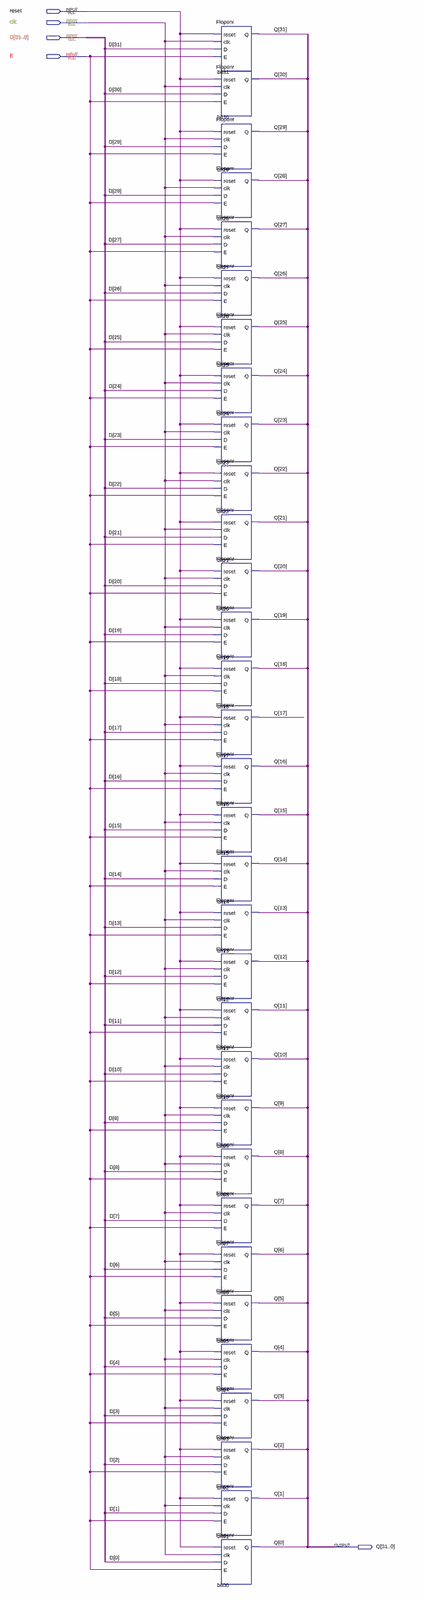
[diagram p0: schematic sheet, whole]
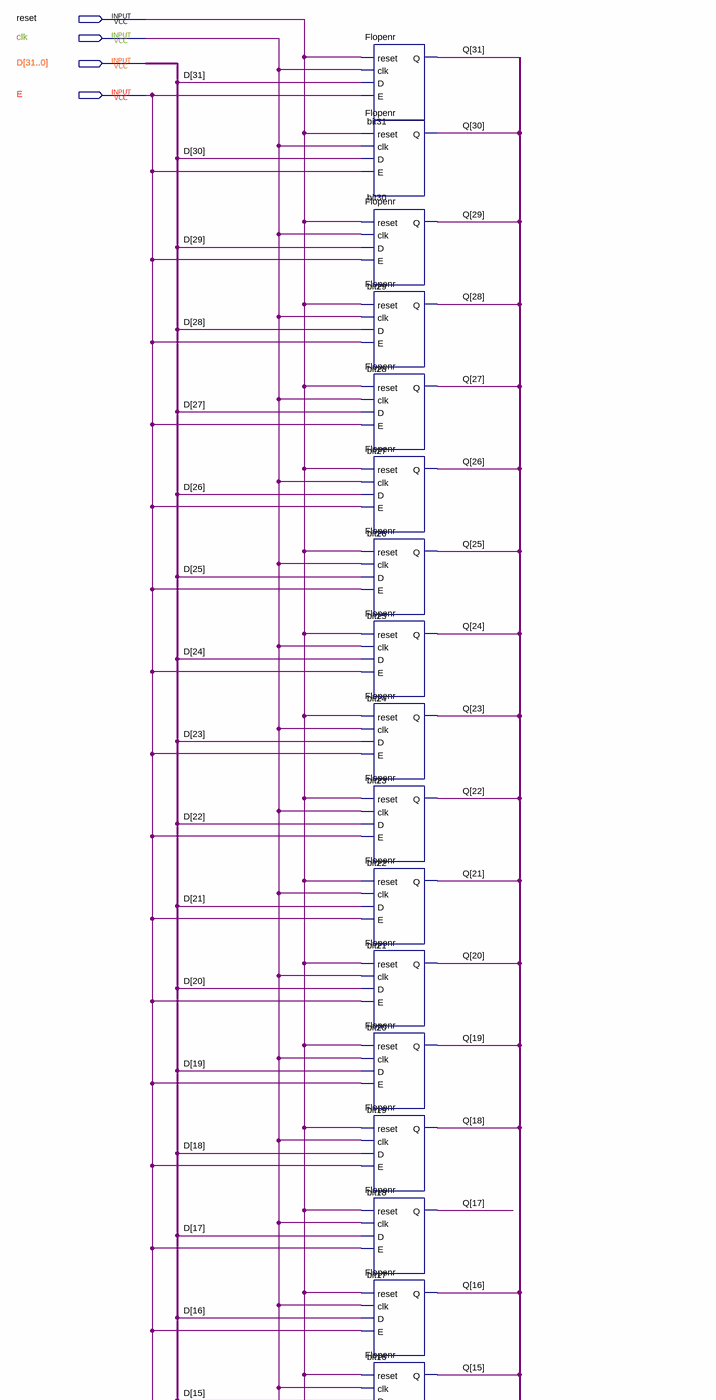
[diagram p1: schematic sheet, upper part]
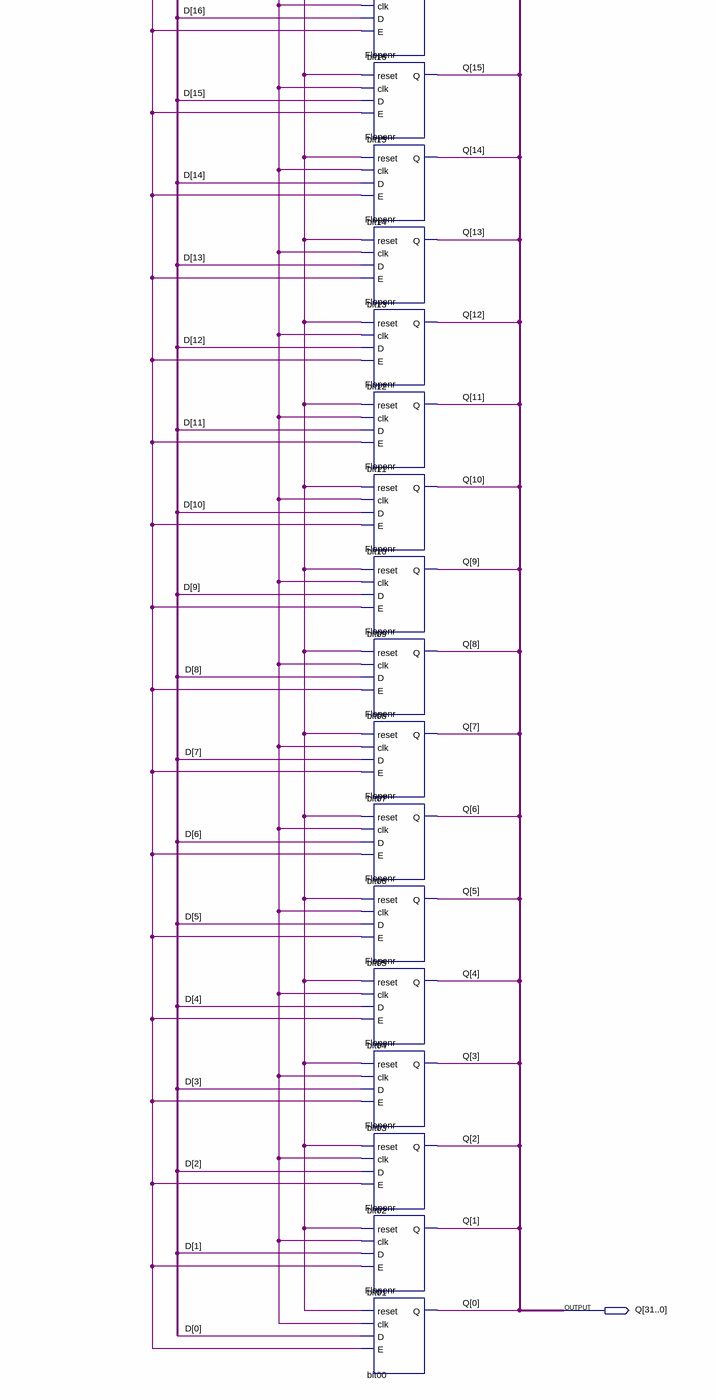
[diagram p2: schematic sheet, lower part]
// Quartus schematic Flopenr_32.bdf as structural Verilog: 32 symbols, 5 pins
module Flopenr_32 (
  input  reset,
  input  clk,
  input  [31:0] D,
  input  E,
  output [31:0] Q
);

  Flopenr bit31 (.reset(reset), .clk(clk), .D(D[31]), .E(E), .Q(Q[31]));
  Flopenr bit30 (.reset(reset), .clk(clk), .D(D[30]), .E(E), .Q(Q[30]));
  Flopenr bit29 (.reset(reset), .clk(clk), .D(D[29]), .E(E), .Q(Q[29]));
  Flopenr bit28 (.reset(reset), .clk(clk), .D(D[28]), .E(E), .Q(Q[28]));
  Flopenr bit27 (.reset(reset), .clk(clk), .D(D[27]), .E(E), .Q(Q[27]));
  Flopenr bit26 (.reset(reset), .clk(clk), .D(D[26]), .E(E), .Q(Q[26]));
  Flopenr bit25 (.reset(reset), .clk(clk), .D(D[25]), .E(E), .Q(Q[25]));
  Flopenr bit24 (.reset(reset), .clk(clk), .D(D[24]), .E(E), .Q(Q[24]));
  Flopenr bit23 (.reset(reset), .clk(clk), .D(D[23]), .E(E), .Q(Q[23]));
  Flopenr bit22 (.reset(reset), .clk(clk), .D(D[22]), .E(E), .Q(Q[22]));
  Flopenr bit21 (.reset(reset), .clk(clk), .D(D[21]), .E(E), .Q(Q[21]));
  Flopenr bit20 (.reset(reset), .clk(clk), .D(D[20]), .E(E), .Q(Q[20]));
  Flopenr bit19 (.reset(reset), .clk(clk), .D(D[19]), .E(E), .Q(Q[19]));
  Flopenr bit18 (.reset(reset), .clk(clk), .D(D[18]), .E(E), .Q(Q[18]));
  Flopenr bit17 (.reset(reset), .clk(clk), .D(D[17]), .E(E), .Q(Q[17]));
  Flopenr bit16 (.reset(reset), .clk(clk), .D(D[16]), .E(E), .Q(Q[16]));
  Flopenr bit15 (.reset(reset), .clk(clk), .D(D[15]), .E(E), .Q(Q[15]));
  Flopenr bit14 (.reset(reset), .clk(clk), .D(D[14]), .E(E), .Q(Q[14]));
  Flopenr bit13 (.reset(reset), .clk(clk), .D(D[13]), .E(E), .Q(Q[13]));
  Flopenr bit12 (.reset(reset), .clk(clk), .D(D[12]), .E(E), .Q(Q[12]));
  Flopenr bit11 (.reset(reset), .clk(clk), .D(D[11]), .E(E), .Q(Q[11]));
  Flopenr bit10 (.reset(reset), .clk(clk), .D(D[10]), .E(E), .Q(Q[10]));
  Flopenr bit09 (.reset(reset), .clk(clk), .D(D[9]), .E(E), .Q(Q[9]));
  Flopenr bit08 (.reset(reset), .clk(clk), .D(D[8]), .E(E), .Q(Q[8]));
  Flopenr bit07 (.reset(reset), .clk(clk), .D(D[7]), .E(E), .Q(Q[7]));
  Flopenr bit06 (.reset(reset), .clk(clk), .D(D[6]), .E(E), .Q(Q[6]));
  Flopenr bit05 (.reset(reset), .clk(clk), .D(D[5]), .E(E), .Q(Q[5]));
  Flopenr bit04 (.reset(reset), .clk(clk), .D(D[4]), .E(E), .Q(Q[4]));
  Flopenr bit03 (.reset(reset), .clk(clk), .D(D[3]), .E(E), .Q(Q[3]));
  Flopenr bit02 (.reset(reset), .clk(clk), .D(D[2]), .E(E), .Q(Q[2]));
  Flopenr bit01 (.reset(reset), .clk(clk), .D(D[1]), .E(E), .Q(Q[1]));
  Flopenr bit00 (.reset(reset), .clk(clk), .D(D[0]), .E(E), .Q(Q[0]));
endmodule
